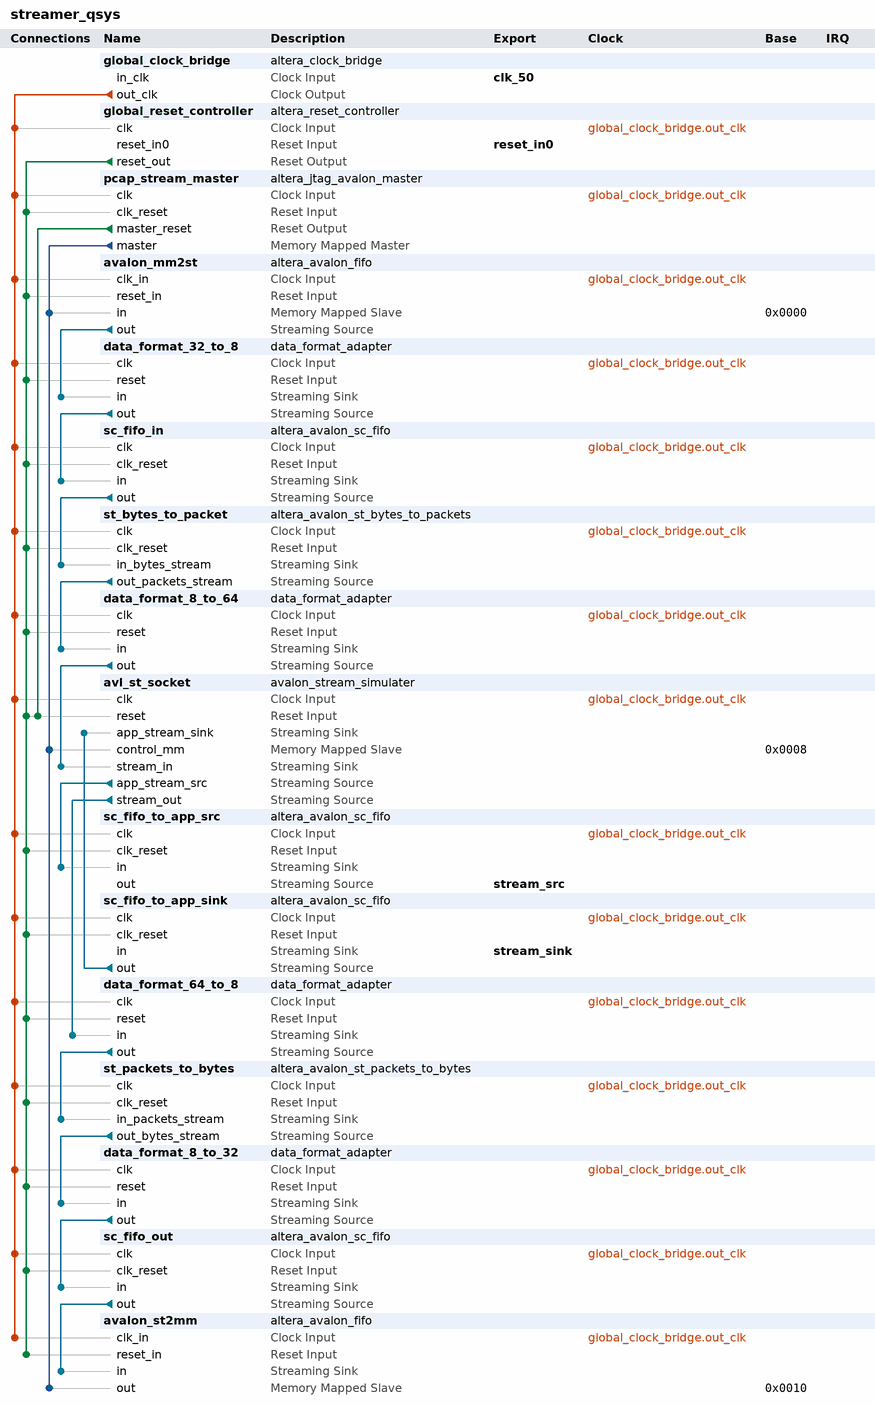
[diagram p0: system contents]
# Platform Designer (Qsys) system streamer_qsys, Cyclone V 5CSXFC6D6F31C8
# Parameters at their usual value, and those the tool derives, are not listed.
package require -exact qsys 13.1
create_system streamer_qsys
set_project_property DEVICE_FAMILY {Cyclone V}
set_project_property DEVICE 5CSXFC6D6F31C8

add_instance global_clock_bridge altera_clock_bridge 13.1
set_instance_parameter_value global_clock_bridge DERIVED_CLOCK_RATE 0
set_instance_parameter_value global_clock_bridge EXPLICIT_CLOCK_RATE 50000000

add_instance global_reset_controller altera_reset_controller 13.1
set_instance_parameter_value global_reset_controller NUM_RESET_INPUTS 1
set_instance_parameter_value global_reset_controller SYNC_DEPTH 2

add_instance pcap_stream_master altera_jtag_avalon_master 13.1

add_instance avalon_mm2st altera_avalon_fifo 13.1
set_instance_parameter_value avalon_mm2st bitsPerSymbol 8
set_instance_parameter_value avalon_mm2st channelWidth 0
set_instance_parameter_value avalon_mm2st errorWidth 0
set_instance_parameter_value avalon_mm2st fifoDepth 512
set_instance_parameter_value avalon_mm2st fifoInputInterfaceOptions AVALONMM_WRITE
set_instance_parameter_value avalon_mm2st fifoOutputInterfaceOptions AVALONST_SOURCE
set_instance_parameter_value avalon_mm2st singleClockMode true
set_instance_parameter_value avalon_mm2st singleResetMode true
set_instance_parameter_value avalon_mm2st symbolsPerBeat 4
set_instance_parameter_value avalon_mm2st useIRQ true
set_instance_parameter_value avalon_mm2st usePacket false
set_instance_parameter_value avalon_mm2st useReadControl false
set_instance_parameter_value avalon_mm2st useWriteControl false

add_instance data_format_32_to_8 data_format_adapter 13.1
set_instance_parameter_value data_format_32_to_8 generationLanguage VERILOG
set_instance_parameter_value data_format_32_to_8 inBitsPerSymbol 8
set_instance_parameter_value data_format_32_to_8 inChannelWidth 0
set_instance_parameter_value data_format_32_to_8 inErrorWidth 0
set_instance_parameter_value data_format_32_to_8 inMaxChannel 0
set_instance_parameter_value data_format_32_to_8 inReadyLatency 0
set_instance_parameter_value data_format_32_to_8 inSymbolsPerBeat 4
set_instance_parameter_value data_format_32_to_8 inUseEmpty false
set_instance_parameter_value data_format_32_to_8 inUseEmptyPort AUTO
set_instance_parameter_value data_format_32_to_8 inUsePackets false
set_instance_parameter_value data_format_32_to_8 inUseReady true
set_instance_parameter_value data_format_32_to_8 outSymbolsPerBeat 1
set_instance_parameter_value data_format_32_to_8 outUseEmpty false
set_instance_parameter_value data_format_32_to_8 outUseEmptyPort AUTO

add_instance sc_fifo_in altera_avalon_sc_fifo 13.1
set_instance_parameter_value sc_fifo_in BITS_PER_SYMBOL 8
set_instance_parameter_value sc_fifo_in FIFO_DEPTH 1024
set_instance_parameter_value sc_fifo_in CHANNEL_WIDTH 0
set_instance_parameter_value sc_fifo_in ERROR_WIDTH 0
set_instance_parameter_value sc_fifo_in USE_FILL_LEVEL 0
set_instance_parameter_value sc_fifo_in USE_MEMORY_BLOCKS 1
set_instance_parameter_value sc_fifo_in USE_STORE_FORWARD 0

add_instance st_bytes_to_packet altera_avalon_st_bytes_to_packets 13.1
set_instance_parameter_value st_bytes_to_packet CHANNEL_WIDTH 8
set_instance_parameter_value st_bytes_to_packet ENCODING 0

add_instance data_format_8_to_64 data_format_adapter 13.1
set_instance_parameter_value data_format_8_to_64 generationLanguage VERILOG
set_instance_parameter_value data_format_8_to_64 inBitsPerSymbol 8
set_instance_parameter_value data_format_8_to_64 inChannelWidth 0
set_instance_parameter_value data_format_8_to_64 inErrorWidth 0
set_instance_parameter_value data_format_8_to_64 inMaxChannel 0
set_instance_parameter_value data_format_8_to_64 inReadyLatency 0
set_instance_parameter_value data_format_8_to_64 inSymbolsPerBeat 1
set_instance_parameter_value data_format_8_to_64 inUseEmpty false
set_instance_parameter_value data_format_8_to_64 inUseEmptyPort AUTO
set_instance_parameter_value data_format_8_to_64 inUsePackets true
set_instance_parameter_value data_format_8_to_64 inUseReady true
set_instance_parameter_value data_format_8_to_64 outSymbolsPerBeat 8
set_instance_parameter_value data_format_8_to_64 outUseEmpty false
set_instance_parameter_value data_format_8_to_64 outUseEmptyPort AUTO

add_instance avl_st_socket avalon_stream_simulater 2.0
set_instance_parameter_value avl_st_socket error_width 1
set_instance_parameter_value avl_st_socket stdata_width 64
set_instance_parameter_value avl_st_socket mmdata_width 8
set_instance_parameter_value avl_st_socket addr_width 3
set_instance_parameter_value avl_st_socket empty_width 3

add_instance sc_fifo_to_app_src altera_avalon_sc_fifo 13.1
set_instance_parameter_value sc_fifo_to_app_src SYMBOLS_PER_BEAT 8
set_instance_parameter_value sc_fifo_to_app_src BITS_PER_SYMBOL 8
set_instance_parameter_value sc_fifo_to_app_src FIFO_DEPTH 16
set_instance_parameter_value sc_fifo_to_app_src CHANNEL_WIDTH 0
set_instance_parameter_value sc_fifo_to_app_src ERROR_WIDTH 0
set_instance_parameter_value sc_fifo_to_app_src USE_PACKETS 1
set_instance_parameter_value sc_fifo_to_app_src USE_FILL_LEVEL 0
set_instance_parameter_value sc_fifo_to_app_src USE_MEMORY_BLOCKS 1
set_instance_parameter_value sc_fifo_to_app_src USE_STORE_FORWARD 0

add_instance sc_fifo_to_app_sink altera_avalon_sc_fifo 13.1
set_instance_parameter_value sc_fifo_to_app_sink SYMBOLS_PER_BEAT 8
set_instance_parameter_value sc_fifo_to_app_sink BITS_PER_SYMBOL 8
set_instance_parameter_value sc_fifo_to_app_sink FIFO_DEPTH 16
set_instance_parameter_value sc_fifo_to_app_sink CHANNEL_WIDTH 0
set_instance_parameter_value sc_fifo_to_app_sink ERROR_WIDTH 0
set_instance_parameter_value sc_fifo_to_app_sink USE_PACKETS 1
set_instance_parameter_value sc_fifo_to_app_sink USE_FILL_LEVEL 0
set_instance_parameter_value sc_fifo_to_app_sink USE_MEMORY_BLOCKS 1
set_instance_parameter_value sc_fifo_to_app_sink USE_STORE_FORWARD 0

add_instance data_format_64_to_8 data_format_adapter 13.1
set_instance_parameter_value data_format_64_to_8 generationLanguage VERILOG
set_instance_parameter_value data_format_64_to_8 inBitsPerSymbol 8
set_instance_parameter_value data_format_64_to_8 inChannelWidth 0
set_instance_parameter_value data_format_64_to_8 inErrorWidth 0
set_instance_parameter_value data_format_64_to_8 inMaxChannel 0
set_instance_parameter_value data_format_64_to_8 inReadyLatency 0
set_instance_parameter_value data_format_64_to_8 inSymbolsPerBeat 8
set_instance_parameter_value data_format_64_to_8 inUseEmpty false
set_instance_parameter_value data_format_64_to_8 inUseEmptyPort AUTO
set_instance_parameter_value data_format_64_to_8 inUsePackets true
set_instance_parameter_value data_format_64_to_8 inUseReady true
set_instance_parameter_value data_format_64_to_8 outSymbolsPerBeat 1
set_instance_parameter_value data_format_64_to_8 outUseEmpty false
set_instance_parameter_value data_format_64_to_8 outUseEmptyPort AUTO

add_instance st_packets_to_bytes altera_avalon_st_packets_to_bytes 13.1
set_instance_parameter_value st_packets_to_bytes CHANNEL_WIDTH 8
set_instance_parameter_value st_packets_to_bytes ENCODING 0

add_instance data_format_8_to_32 data_format_adapter 13.1
set_instance_parameter_value data_format_8_to_32 generationLanguage VERILOG
set_instance_parameter_value data_format_8_to_32 inBitsPerSymbol 8
set_instance_parameter_value data_format_8_to_32 inChannelWidth 0
set_instance_parameter_value data_format_8_to_32 inErrorWidth 0
set_instance_parameter_value data_format_8_to_32 inMaxChannel 0
set_instance_parameter_value data_format_8_to_32 inReadyLatency 0
set_instance_parameter_value data_format_8_to_32 inSymbolsPerBeat 1
set_instance_parameter_value data_format_8_to_32 inUseEmpty false
set_instance_parameter_value data_format_8_to_32 inUseEmptyPort AUTO
set_instance_parameter_value data_format_8_to_32 inUsePackets false
set_instance_parameter_value data_format_8_to_32 inUseReady true
set_instance_parameter_value data_format_8_to_32 outSymbolsPerBeat 4
set_instance_parameter_value data_format_8_to_32 outUseEmpty false
set_instance_parameter_value data_format_8_to_32 outUseEmptyPort AUTO

add_instance sc_fifo_out altera_avalon_sc_fifo 13.1
set_instance_parameter_value sc_fifo_out SYMBOLS_PER_BEAT 4
set_instance_parameter_value sc_fifo_out BITS_PER_SYMBOL 8
set_instance_parameter_value sc_fifo_out FIFO_DEPTH 8192
set_instance_parameter_value sc_fifo_out CHANNEL_WIDTH 0
set_instance_parameter_value sc_fifo_out ERROR_WIDTH 0
set_instance_parameter_value sc_fifo_out USE_FILL_LEVEL 0
set_instance_parameter_value sc_fifo_out USE_MEMORY_BLOCKS 1
set_instance_parameter_value sc_fifo_out USE_STORE_FORWARD 0

add_instance avalon_st2mm altera_avalon_fifo 13.1
set_instance_parameter_value avalon_st2mm bitsPerSymbol 8
set_instance_parameter_value avalon_st2mm channelWidth 0
set_instance_parameter_value avalon_st2mm errorWidth 0
set_instance_parameter_value avalon_st2mm fifoDepth 16
set_instance_parameter_value avalon_st2mm fifoInputInterfaceOptions AVALONST_SINK
set_instance_parameter_value avalon_st2mm fifoOutputInterfaceOptions AVALONMM_READ
set_instance_parameter_value avalon_st2mm singleClockMode true
set_instance_parameter_value avalon_st2mm singleResetMode true
set_instance_parameter_value avalon_st2mm symbolsPerBeat 4
set_instance_parameter_value avalon_st2mm useBackpressure false
set_instance_parameter_value avalon_st2mm useIRQ true
set_instance_parameter_value avalon_st2mm usePacket false
set_instance_parameter_value avalon_st2mm useReadControl false
set_instance_parameter_value avalon_st2mm useWriteControl false

# connections
add_connection global_clock_bridge.out_clk avalon_mm2st.clk_in clock
add_connection global_clock_bridge.out_clk avalon_st2mm.clk_in clock
add_connection global_clock_bridge.out_clk avl_st_socket.clk clock
add_connection global_clock_bridge.out_clk data_format_8_to_32.clk clock
add_connection global_clock_bridge.out_clk data_format_8_to_64.clk clock
add_connection global_clock_bridge.out_clk data_format_32_to_8.clk clock
add_connection global_clock_bridge.out_clk data_format_64_to_8.clk clock
add_connection global_clock_bridge.out_clk global_reset_controller.clk clock
add_connection global_clock_bridge.out_clk pcap_stream_master.clk clock
add_connection global_clock_bridge.out_clk sc_fifo_in.clk clock
add_connection global_clock_bridge.out_clk sc_fifo_out.clk clock
add_connection global_clock_bridge.out_clk sc_fifo_to_app_sink.clk clock
add_connection global_clock_bridge.out_clk sc_fifo_to_app_src.clk clock
add_connection global_clock_bridge.out_clk st_bytes_to_packet.clk clock
add_connection global_clock_bridge.out_clk st_packets_to_bytes.clk clock
add_connection global_reset_controller.reset_out avalon_mm2st.reset_in reset
add_connection global_reset_controller.reset_out avalon_st2mm.reset_in reset
add_connection global_reset_controller.reset_out avl_st_socket.reset reset
add_connection global_reset_controller.reset_out data_format_8_to_32.reset reset
add_connection global_reset_controller.reset_out data_format_8_to_64.reset reset
add_connection global_reset_controller.reset_out data_format_32_to_8.reset reset
add_connection global_reset_controller.reset_out data_format_64_to_8.reset reset
add_connection global_reset_controller.reset_out pcap_stream_master.clk_reset reset
add_connection global_reset_controller.reset_out sc_fifo_in.clk_reset reset
add_connection global_reset_controller.reset_out sc_fifo_out.clk_reset reset
add_connection global_reset_controller.reset_out sc_fifo_to_app_sink.clk_reset reset
add_connection global_reset_controller.reset_out sc_fifo_to_app_src.clk_reset reset
add_connection global_reset_controller.reset_out st_bytes_to_packet.clk_reset reset
add_connection global_reset_controller.reset_out st_packets_to_bytes.clk_reset reset
add_connection pcap_stream_master.master_reset avl_st_socket.reset reset
add_connection pcap_stream_master.master avalon_mm2st.in avalon
set_connection_parameter_value pcap_stream_master.master/avalon_mm2st.in baseAddress 0x0000
add_connection pcap_stream_master.master avalon_st2mm.out avalon
set_connection_parameter_value pcap_stream_master.master/avalon_st2mm.out baseAddress 0x0010
add_connection pcap_stream_master.master avl_st_socket.control_mm avalon
set_connection_parameter_value pcap_stream_master.master/avl_st_socket.control_mm baseAddress 0x0008
add_connection avalon_mm2st.out data_format_32_to_8.in avalon_streaming
add_connection avl_st_socket.app_stream_src sc_fifo_to_app_src.in avalon_streaming
add_connection avl_st_socket.stream_out data_format_64_to_8.in avalon_streaming
add_connection data_format_8_to_32.out sc_fifo_out.in avalon_streaming
add_connection data_format_8_to_64.out avl_st_socket.stream_in avalon_streaming
add_connection data_format_32_to_8.out sc_fifo_in.in avalon_streaming
add_connection data_format_64_to_8.out st_packets_to_bytes.in_packets_stream avalon_streaming
add_connection sc_fifo_in.out st_bytes_to_packet.in_bytes_stream avalon_streaming
add_connection sc_fifo_out.out avalon_st2mm.in avalon_streaming
add_connection sc_fifo_to_app_sink.out avl_st_socket.app_stream_sink avalon_streaming
add_connection st_bytes_to_packet.out_packets_stream data_format_8_to_64.in avalon_streaming
add_connection st_packets_to_bytes.out_bytes_stream data_format_8_to_32.in avalon_streaming

# exported interfaces
add_interface clk_50 clock sink
set_interface_property clk_50 EXPORT_OF global_clock_bridge.in_clk
add_interface reset_in0 reset sink
set_interface_property reset_in0 EXPORT_OF global_reset_controller.reset_in0
add_interface stream_src avalon_streaming source
set_interface_property stream_src EXPORT_OF sc_fifo_to_app_src.out
add_interface stream_sink avalon_streaming sink
set_interface_property stream_sink EXPORT_OF sc_fifo_to_app_sink.in

set_interconnect_requirement {$system} qsys_mm.clockCrossingAdapter HANDSHAKE
set_interconnect_requirement {$system} qsys_mm.maxAdditionalLatency 1

save_system streamer_qsys.qsys
